# EAGLE design hib_main_7 (EAGLE 7.7.0)

## Sheet 1 of 3: Supply
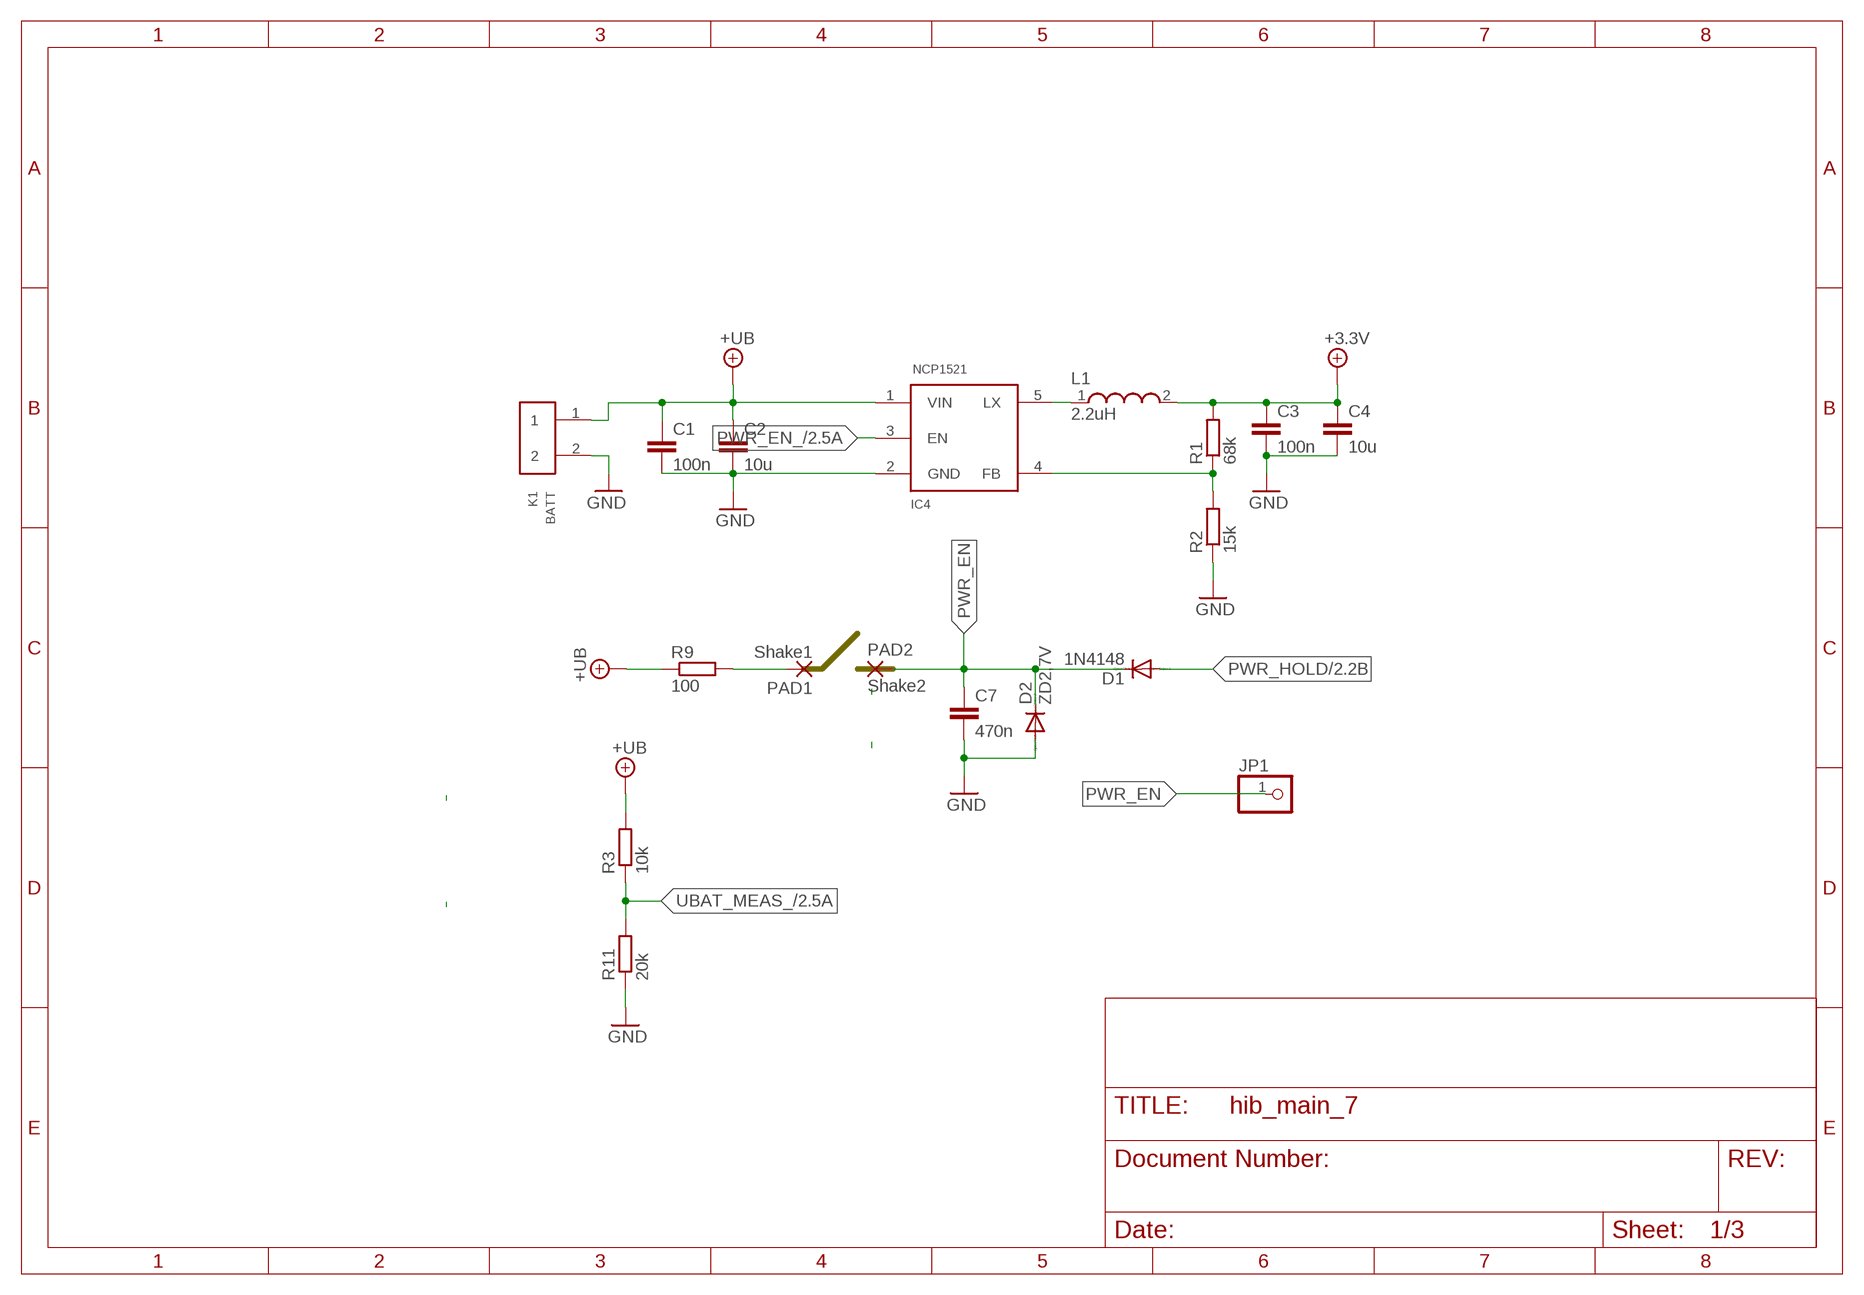
[diagram p0: schematic, sheet 1]

### Parts
C1  100n  C-EUC0805K  [C0805K]
C2  10u  C-EUC0805K  [C0805K]
C3  100n  C-EUC0805M  [C0805M]
C4  10u  C-EUC0805M  [C0805M]
C7  470n  C-EUC0805M  [C0805M]
D1  1N4148  DIODE-MINIMELF  [MINIMELF]
D2  ZD2,7V  DIODE-MINIMELF  [MINIMELF]
IC4  NCP1521  [SOT23-5L]
JP1  PINHD-1X1  [1X01]
K1  BATT  620102131822  [620102131822]
L1  2.2uH  WE-MPSB_0805(HC)  [WE-MPSB_0805(W=4.0)]
PAD1  Shake1  WIREPADSMD1,27-254  [SMD1,27-2,54]
PAD2  Shake2  WIREPADSMD1,27-254  [SMD1,27-2,54]
R1  68k  R-EU_R0603  [R0603]
R2  15k  R-EU_R0603  [R0603]
R3  10k  R-EU_R0603  [R0603]
R9  100  R-EU_R0603  [R0603]
R11  20k  R-EU_R0603  [R0603]

### Nets
+3,3V: C3.1 C4.1 L1.2 R1.2 ; supply symbol labelled +3.3V ; also sheet 2,3
+UB: C1.1 C2.1 IC4.1(VIN) K1.1 R3.2 R9.1 ; also sheet 3
GND: C1.2 C2.2 C3.2 C4.2 C7.2 D2.A IC4.2(GND) K1.2 R2.1 R11.1 ; also sheet 2,3
N$1: IC4.5(LX) L1.1
N$3: IC4.4(FB) R1.1 R2.2
N$11: PAD1.1(P) R9.2
PWR_EN: C7.1 D1.C D2.C JP1.1 PAD2.1(P)
PWR_EN_: IC4.3(EN) ; also sheet 2
PWR_HOLD: D1.A ; also sheet 2
UBAT_MEAS_: R3.1 R11.2 ; also sheet 2

## Sheet 2 of 3: Controller
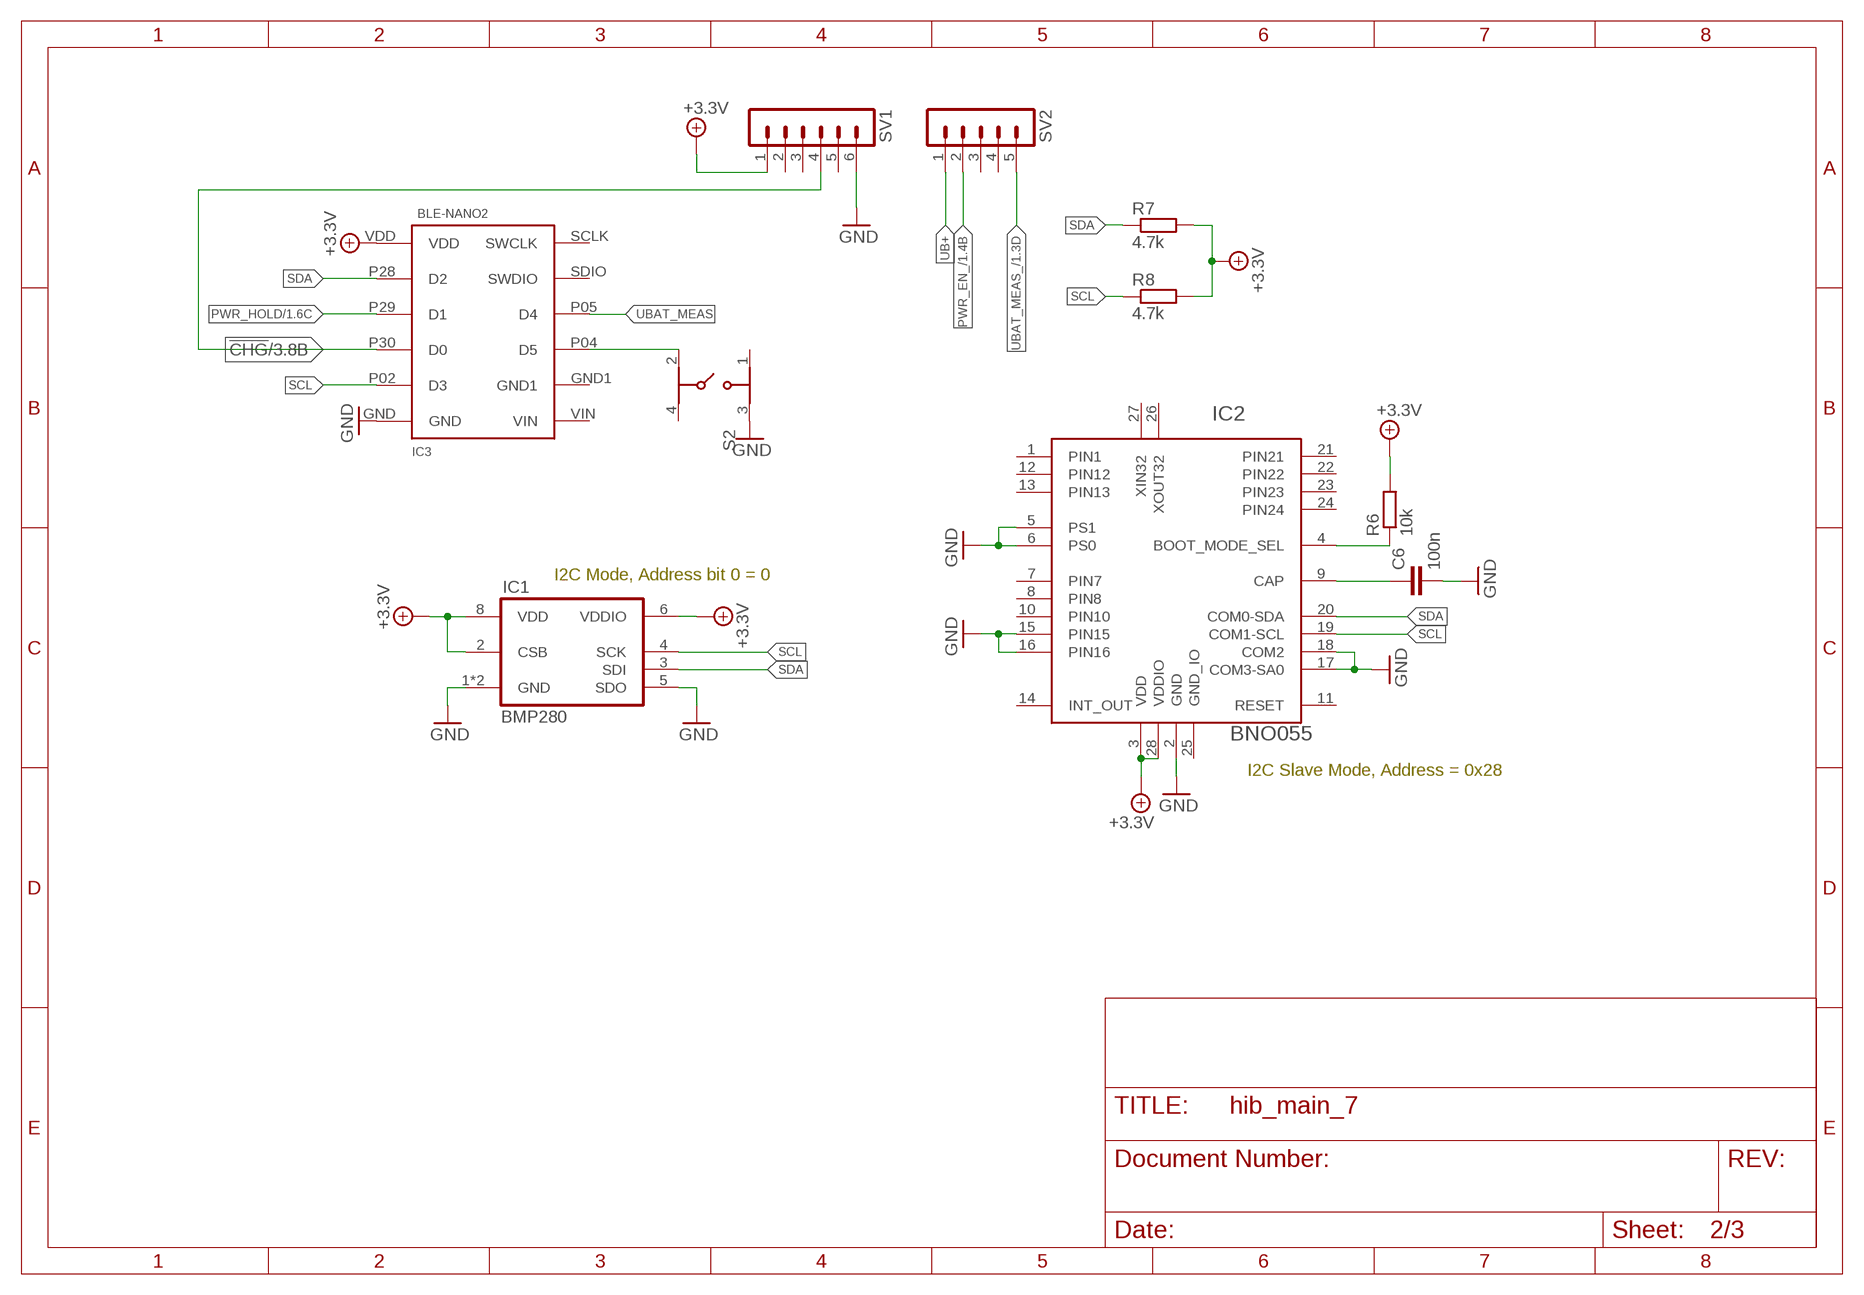
[diagram p1: schematic, sheet 2]

### Parts
C6  100n  C-EUC0805M  [C0805M]
IC1  BMP280  [BMP280]
IC2  BNO055  1658_BNO055  [LGA-28_3.80X5.20/0.5]
IC3  BLE-NANO2  [BLE-NANO2]
R6  10k  R-EU_R0805M  [R0805M]
R7  4.7k  R-EU_R0805M  [R0805M]
R8  4.7k  R-EU_R0805M  [R0805M]
S2  434153017835  [434153017835]
SV1  MA06-1  [MA06-1]
SV2  MA05-1  [MA05-1]

### Nets
!CHG!: IC3.P30(D0) SV1.4 ; also sheet 3
+3,3V: IC1.2(CSB) IC1.6(VDDIO) IC1.8(VDD) IC2.3(VDD) IC2.28(VDDIO) IC3.VDD R6.2 R7.2 R8.2 SV1.1 ; supply symbol labelled +3.3V ; also sheet 1,3
GND: C6.2 IC1.1(GND) IC1.5(SDO) IC1.7(GND) IC2.2(GND) IC2.5(PS1) IC2.6(PS0) IC2.15(PIN15) IC2.16(PIN16) IC2.17(COM3-SA0) IC2.18(COM2) IC3.GND S2.3 SV1.6 ; also sheet 1,3
N$4: C6.1 IC2.9(CAP)
N$6: IC2.4(BOOT_MODE_SEL) R6.1
PWR_EN_: SV2.2 ; also sheet 1
PWR_HOLD: IC3.P29(D1) ; also sheet 1
RESET: IC3.P04(D5) S2.2
SCL: IC1.4(SCK) IC2.19(COM1-SCL) IC3.P02(D3) R8.1
SDA: IC1.3(SDI) IC2.20(COM0-SDA) IC3.P28(D2) R7.1
UB+: SV2.1
UBAT_MEAS: IC3.P05(D4)
UBAT_MEAS_: SV2.5 ; also sheet 1
Unconnected: IC2.1(PIN1) IC2.7(PIN7) IC2.8(PIN8) IC2.10(PIN10) IC2.11(RESET) IC2.12(PIN12) IC2.13(PIN13) IC2.14(INT_OUT) IC2.21(PIN21) IC2.22(PIN22) IC2.23(PIN23) IC2.24(PIN24) IC2.26(XOUT32) IC2.27(XIN32) IC3.GND1 IC3.SCLK(SWCLK) IC3.SDIO(SWDIO) IC3.VIN S2.1 S2.4 SV1.2 SV1.3 SV1.5 SV2.3 SV2.4

### Notes on the sheet
- I2C Mode, Address bit 0 = 0
- I2C Slave Mode, Address = 0x28

## Sheet 3 of 3: Wireless supply
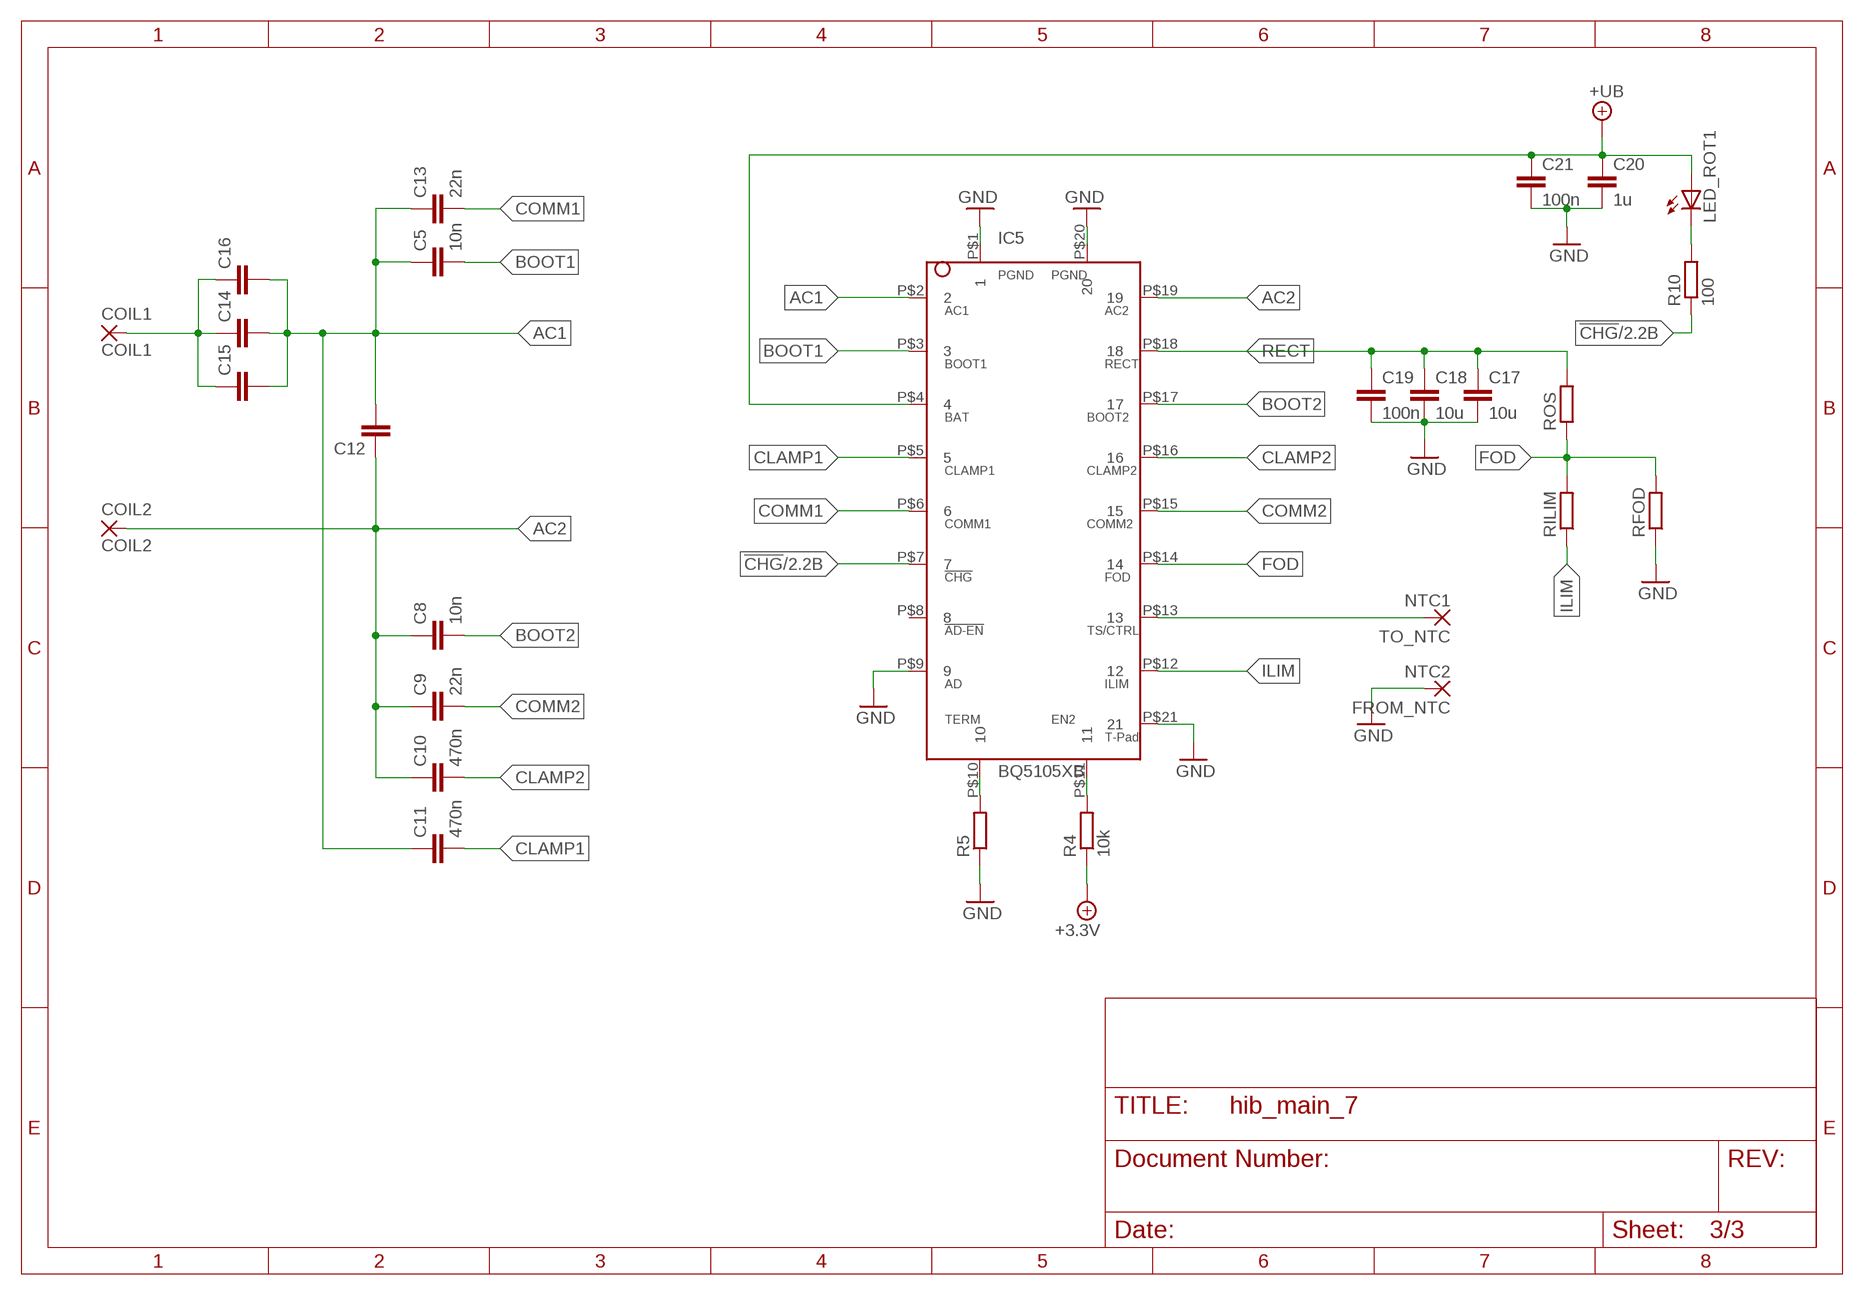
[diagram p2: schematic, sheet 3]

### Parts
C5  10n  C-EUC0603K  [C0603K]
C8  10n  C-EUC0603K  [C0603K]
C9  22n  C-EUC0603K  [C0603K]
C10  470n  C-EUC0603K  [C0603K]
C11  470n  C-EUC0603K  [C0603K]
C12  C-EUC0603K  [C0603K]
C13  22n  C-EUC0603K  [C0603K]
C14  C-EUC0603K  [C0603K]
C15  C-EUC0603K  [C0603K]
C16  C-EUC0603K  [C0603K]
C17  10u  C-EUC0603K  [C0603K]
C18  10u  C-EUC0603K  [C0603K]
C19  100n  C-EUC0603K  [C0603K]
C20  1u  C-EUC0603K  [C0603K]
C21  100n  C-EUC0603K  [C0603K]
COIL1  COIL1  WIREPADSMD1,27-254  [SMD1,27-2,54]
COIL2  COIL2  WIREPADSMD1,27-254  [SMD1,27-2,54]
FROM_NTC  NTC2  WIREPADSMD1,27-254  [SMD1,27-2,54]
IC5  BQ5105XB  [VQFN_BQ5105B]
LED_ROT1  LEDCHIP-LED0603  [CHIP-LED0603]
R4  10k  R-EU_R0805  [R0805]
R5  R-EU_R0603  [R0603]
R10  100  R-EU_R0603  [R0603]
RFOD  R-EU_R0805  [R0805]
RILIM  R-EU_R0805  [R0805]
ROS  R-EU_R0805  [R0805]
TO_NTC  NTC1  WIREPADSMD1,27-254  [SMD1,27-2,54]

### Nets
!CHG!: IC5.P$7 R10.1 ; also sheet 2
+3,3V: R4.1 ; supply symbol labelled +3.3V ; also sheet 1,2
+UB: C20.1 C21.1 IC5.P$4 LED_ROT1.A ; also sheet 1
AC1: C5.1 C11.1 C12.2 C13.1 C14.2 C15.2 C16.2 IC5.P$2
AC2: C8.1 C9.1 C10.1 C12.1 COIL2.1(P) IC5.P$19
BOOT1: C5.2 IC5.P$3
BOOT2: C8.2 IC5.P$17
CLAMP1: C11.2 IC5.P$5
CLAMP2: C10.2 IC5.P$16
COMM1: C13.2 IC5.P$6
COMM2: C9.2 IC5.P$15
FOD: IC5.P$14 RFOD.2 RILIM.2 ROS.1
GND: C17.2 C18.2 C19.2 C20.2 C21.2 FROM_NTC.1(P) IC5.P$1 IC5.P$9 IC5.P$20 IC5.P$21 R5.1 RFOD.1 ; also sheet 1,2
ILIM: IC5.P$12 RILIM.1
N$2: C14.1 C15.1 C16.1 COIL1.1(P)
N$5: IC5.P$10 R5.2
N$7: IC5.P$11 R4.2
N$8: LED_ROT1.C R10.2
RECT: C17.1 C18.1 C19.1 IC5.P$18 ROS.2
TS/CTRL: IC5.P$13 TO_NTC.1(P)
Unconnected: IC5.P$8

## Power pins joined to a net without a drawn wire
GND_IO: IC2.25(GND_IO)

## Library data of the parts
C1 C2 C5 C8-C21 = rcl@1:C-EU: CAPACITOR, European symbol
C3 C4 C6 C7 = rcl:C-EU: CAPACITOR, European symbol
COIL1 COIL2 FROM_NTC TO_NTC = wirepad@1:WIREPAD: Wire PAD connect wire on PCB
D1 D2 = diode:DIODE-: DIODE
IC1 = bosch-bmp280:BMP280: The BMP280 is an absolute barometric pressure sensor especially designed for mobile applications. The sensor module is housed in an extremely compact 8-pin metal-lid LGA package with a footprint of only 2.0 × 2.5 mm2 and 0.95 mm package height. Its small dimensions and its low power consumption of 2.7 μA @1Hz allow the implementation in battery driven devices such as mobile phones, GPS modules or watches. The library has been designed by Richard Magdycz <https://www.facebook.com/groups/eaglecadsoftUK>
IC2 = BNO055:1658_BNO055: BN055 Intelligent 9-axis absolute orientation sensor; PART_NUMBER: BNO055; VALUE: BN055
IC3 = redbearlabs:BLE-NANO2
IC4 = on-semiconductor:NCP1521: NCP1521B 1.5 MHz, 600 mA Step-Down DC-DC Converter
IC5 = BQ51050B_original:BQ5105XB
JP1 = pinhead:PINHD-1X1: PIN HEADER
K1 = Eagle_WIRE-TO-BOARD_rev15d:620102131822: WR-WTB 2.00mm SMT Male Horizontal Shrouded Header, 2 Pins=>Code : Con_WTB_2.00_PCB_SMT_620102131822 <http://katalog.we-online.de/media/thumbs2/eican/thb_Con_WTB_2.00_PCB_SMT_6201xx131822_pf2.jpg> Details see: http://katalog.we-online.de/en/em/620_1xx_131_822 Created 2014-06-05, Karrer Zheng 2014 (C) Würth Elektronik
L1 = EagleLibrary_Wuerth_Elektronik_eiSos_rev16a:WE-MPSB: SMD EMI Multilayer Power Suppression Bead Characteristics High rated current up to 10 A Operating temperature: –55 ºC to +125 ºC Very low RDC Applications 77 EMI suppression of DC/DC converters and DC power supply Variant abbreviation WB means WIDE BAND HS means HIGH SPEED HC means HIGH CURRENT <http://katalog.we-online.de/media/images/eisos/FeMPSB_pf2.jpg> Details see: http://katalog.we-online.de/en/pbs/WE-MPSB? Updated by Dan Xu 2014-07-08 2014 (C) Wurth Elektronik
LED_ROT1 = led:LED: LED OSRAM: - CHIPLED LG R971, LG N971, LY N971, LG Q971, LY Q971, LO R971, LY R971 LH N974, LH R974 LS Q976, LO Q976, LY Q976 LO Q996 - Hyper CHIPLED LW Q18S LB Q993, LB Q99A, LB R99A - SideLED LS A670, LO A670, LY A670, LG A670, LP A670 LB A673, LV A673, LT A673, LW A673 LH A674 LY A675 LS A676, LA A676, LO A676, LY A676, LW A676 LS A679, LY A679, LG A679 - Hyper Micro SIDELED® LS Y876, LA Y876, LO Y876, LY Y876 LT Y87S - SmartLED LW L88C, LW L88S LB L89C, LB L89S, LG L890 LS L89K, LO L89K, LY L89K LS L896, LA L896, LO L896, LY L896 - TOPLED LS T670, LO T670, LY T670, LG T670, LP T670 LSG T670, LSP T670, LSY T670, LOP T670, LYG T670 LG T671, LOG T671, LSG T671 LB T673, LV T673, LT T673, LW T673 LH T674 LS T676, LA T676, LO T676, LY T676, LB T676, LH T676, LSB T676, LW T676 LB T67C, LV T67C, LT T67C, LS T67K, LO T67K, LY T67K, LW E67C LS E67B, LA E67B, LO E67B, LY E67B, LB E67C, LV E67C, LT E67C LW T67C LS T679, LY T679, LG T679 LS T770, LO T770, LY T770, LG T770, LP T770 LB T773, LV T773, LT T773, LW T773 LH T774 LS E675, LA E675, LY E675, LS T675 LS T776, LA T776, LO T776, LY T776, LB T776 LHGB T686 LT T68C, LB T68C - Hyper Mini TOPLED® LB M676 - Mini TOPLED Santana® LG M470 LS M47K, LO M47K, LY M47K Source: http://www.osram.convergy.de LUXEON: - LUMILED® LXK2-PW12-R00, LXK2-PW12-S00, LXK2-PW14-U00, LXK2-PW14-V00 LXK2-PM12-R00, LXK2-PM12-S00, LXK2-PM14-U00 LXK2-PE12-Q00, LXK2-PE12-R00, LXK2-PE12-S00, LXK2-PE14-T00, LXK2-PE14-U00 LXK2-PB12-K00, LXK2-PB12-L00, LXK2-PB12-M00, LXK2-PB14-N00, LXK2-PB14-P00, LXK2-PB14-Q00 LXK2-PR12-L00, LXK2-PR12-M00, LXK2-PR14-Q00, LXK2-PR14-R00 LXK2-PD12-Q00, LXK2-PD12-R00, LXK2-PD12-S00 LXK2-PH12-R00, LXK2-PH12-S00 LXK2-PL12-P00, LXK2-PL12-Q00, LXK2-PL12-R00 Source: www.luxeon.com KINGBRIGHT: KA-3528ASYC Source: www.kingbright.com
PAD1 PAD2 = wirepad:WIREPAD: Wire PAD connect wire on PCB
R1-R3 R6-R9 R11 = rcl:R-EU_: RESISTOR, European symbol
R4 R5 R10 RFOD RILIM ROS = rcl@1:R-EU_: RESISTOR, European symbol
S2 = EAGLE-TACT_SWITCHES-rev16e:434153017835: WS-TASV Tact Switch J-Bend SMD version Specification Rating : 50mA, 12VDC Contact Resistance Initial: 100mΩ max. After life test:1mΩ max. Insulation Resistance: min.100MΩ at 500VDC Dielectric Strength : 250VAC for 1 minute Stroke:0.15±0.1mm Bounce :10ms max. Material Cover : : Stainless steel Stem :LCP UL 94 V-0. FramePA46 UL HB, color Black >Contact : Stainless Steel with Silver Tape:Polyimide tape Terminal : Copper Alloy with Silver <http://katalog.we-online.de/media/images/v2/WS-TASU_434331013822_a_4C.jpg> Details see: http://katalog.we-online.de/em/datasheet/434153017835.pdf 2015 (C) Würth Elektronik
SV1 = con-lstb:MA06-1: PIN HEADER; OC_FARNELL: unknown; OC_NEWARK: unknown
SV2 = con-lstb:MA05-1: PIN HEADER; OC_FARNELL: unknown; OC_NEWARK: unknown

## Board
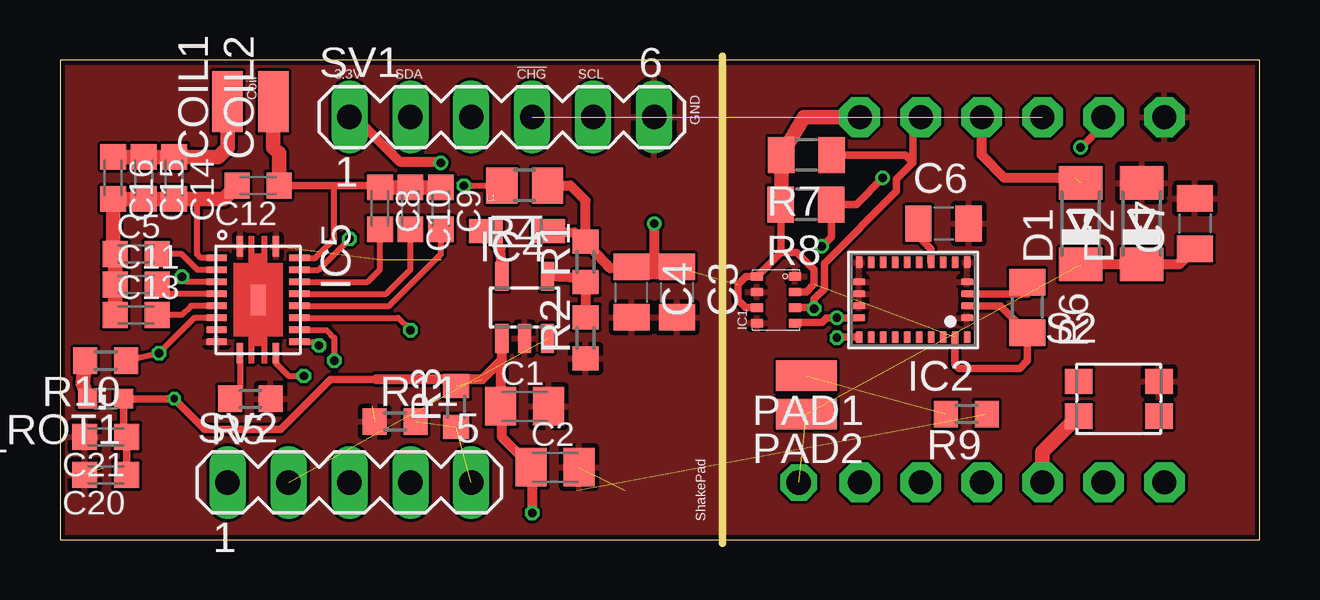
[diagram p3: board, top side]
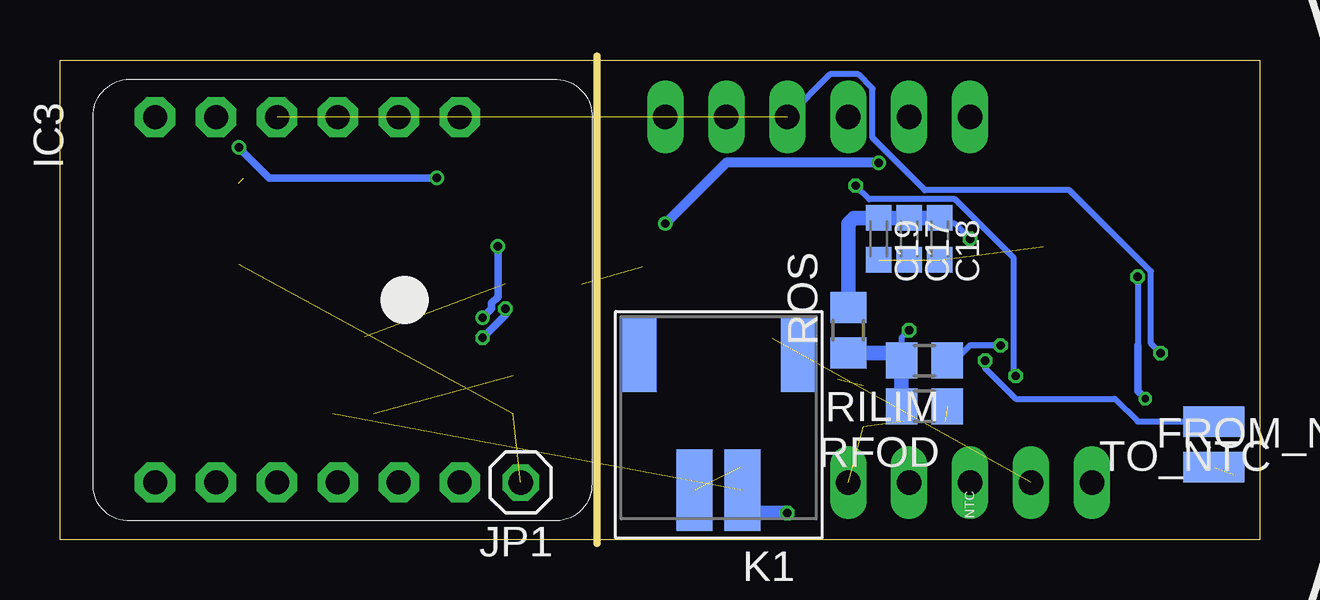
[diagram p4: board, bottom side, seen from below]

Size 50 x 20 mm. Coordinates in mm from the lower left corner, seen from the top.
Outline: 0,0 50,0 50,20 0,20 0,0
Copper layers (1*16): Top 0.018mm / dielectric 1.55mm / Bottom 0.018mm
Design rules "Multi-CB_2L_125um-Tracks_OL35um": minimum track width 0.125mm, minimum drill 0.2mm, track to track 0.125mm, track to pad 0.125mm, pad to pad 0.125mm, via to via 0.125mm, smd to smd 0mil, copper to edge 0.2mm, drill to drill 0.2mm, minimum pad ring 0.125mm, minimum via ring 0.125mm, stop-mask expansion 2mil, vias tented up to drill 0.45mm, thermal gap 0.2mm
Milling: 1 lines

### Footprints (pad centres in the part's own frame; a part is rotated, then mirrored left to right if it is on the bottom)
C0805K = smd 1.3 x 1.6: 1 -1,0; 2 1,0
C0805M = smd 1.1 x 1.5: 1 -1.05,0; 2 1.05,0
C0603K = smd 1.05 x 1.08: 1 -0.875,0; 2 0.875,0
SMD1,27-2,54 = smd 1.27 x 2.54: 1 0,0
MINIMELF = smd 1.4 x 1.8: A 1.7,0; C -1.7,0
BMP280 = smd 0.35 x 0.5: 1 0.975,-0.8; 2 0.325,-0.8; 3 -0.325,-0.8; 4 -0.975,-0.8; 5 -0.975,0.8; 6 -0.325,0.8; 7 0.325,0.8; 8 0.975,0.8
LGA-28_3.80X5.20/0.5 = smd 0.3 x 0.5: 1 -2.25,1.56; 6 -2.25,-1.56; 7 -1.75,-1.56; 8 -1.25,-1.56; 9 -0.75,-1.56; 10 -0.25,-1.56; 11 0.25,-1.56; 12 0.75,-1.56; 13 1.25,-1.56; 14 1.75,-1.56; 15 2.25,-1.56; 20 2.25,1.56; 21 1.75,1.56; 22 1.25,1.56; 23 0.75,1.56; 24 0.25,1.56; 25 -0.25,1.56; 26 -0.75,1.56; 27 -1.25,1.56; 28 -1.75,1.56 | smd 0.5 x 0.3: 2 -2.25,0.75; 3 -2.25,0.25; 4 -2.25,-0.25; 5 -2.25,-0.75; 16 2.25,-0.75; 17 2.25,-0.25; 18 2.25,0.25; 19 2.25,0.75
BLE-NANO2 = drill 1 pad 1.676 octagon: GND 0,0; GND1 15.24,2.54; P02 0,2.54; P04 15.24,5.08; P05 15.24,7.62; P28 0,10.16; P29 0,7.62; P30 0,5.08; SCLK 15.24,12.7; SDIO 15.24,10.16; VDD 0,12.7; VIN 15.24,0
SOT23-5L = smd 0.55 x 1.2: 1 -0.95,-1.3; 2 0,-1.3; 3 0.95,-1.3; 4 0.95,1.3; 5 -0.95,1.3
VQFN_BQ5105B = smd 0.85 x 0.28: P$1 -2.225,-0.75; P$10 2.225,-0.75; P$11 2.225,0.75; P$20 -2.225,0.75 | smd 0.28 x 0.85: P$2 -1.75,-1.725; P$3 -1.25,-1.725; P$4 -0.75,-1.725; P$5 -0.25,-1.725; P$6 0.25,-1.725; P$7 0.75,-1.725; P$8 1.25,-1.725; P$9 1.75,-1.725; P$12 1.75,1.725; P$13 1.25,1.725; P$14 0.75,1.725; P$15 0.25,1.725; P$16 -0.25,1.725; P$17 -0.75,1.725; P$18 -1.25,1.725; P$19 -1.75,1.725 | smd 1.27 x 0.635: P$21 0,0
1X01 = drill 1.016 octagon: 1 0,0
620102131822 = smd 1.5 x 3.4: 1 -1,0; 2 1,0 | smd 1.4 x 3.1: Z1 -3.3,-5.65; Z2 3.3,-5.65
WE-MPSB_0805(W=4.0) = smd 1.4 x 1: 1 -1.3,0; 2 1.3,0
CHIP-LED0603 = smd 0.8 x 0.8: A 0,-0.75; C 0,0.75
R0603 = smd 1 x 1.1: 1 -0.85,0; 2 0.85,0
R0805 = smd 1.3 x 1.5: 1 -0.95,0; 2 0.95,0
R0805M = smd 1.1 x 1.5: 1 -1.05,0; 2 1.05,0
434153017835 = smd 1.15 x 1.05: 1 -1.675,0.725; 2 -1.675,-0.725; 3 1.675,0.725; 4 1.675,-0.725
MA06-1 = drill 1.016 long: 1 -6.35,0; 2 -3.81,0; 3 -1.27,0; 4 1.27,0; 5 3.81,0; 6 6.35,0
MA05-1 = drill 1.016 long: 1 -5.08,0; 2 -2.54,0; 3 0,0; 4 2.54,0; 5 5.08,0

### Placement (x,y rotation side)
C1  19.37,5.55 0 top
C2  20.64,3.01 0 top
C3  25.72,10.32 270 top
C4  23.81,10.32 270 top
C5  3.17,11.9 0 top
C6  36.83,13.18 0 top
C7  47.31,13.18 90 top
C8  13.34,13.81 270 top
C9  15.88,13.81 270 top
C10  14.61,13.81 270 top
C11  3.17,10.63 0 top
C12  8.26,14.76 180 top
C13  3.17,9.37 0 top
C14  4.76,15.08 270 top
C15  3.49,15.08 270 top
C16  2.22,15.08 270 top
C17  14.61,12.54 270 bottom
C18  13.34,12.54 270 bottom
C19  15.88,12.54 270 bottom
C20  1.91,2.7 180 top
C21  1.91,4.29 180 top
COIL1  6.99,18.26 0 top
COIL2  8.89,18.26 0 top
D1  42.55,13.18 90 top
D2  45.09,13.18 90 top
FROM_NTC  1.91,3.01 270 bottom
IC1  29.84,10 90 top
IC2  35.56,10 180 top
IC3  46.04,17.62 270 bottom
IC4  19.37,9.68 0 top
IC5  8.26,10 270 top
JP1  30.8,2.38 180 bottom
K1  22.54,2.06 180 bottom
L1  19.05,12.86 0 top
LED_ROT1  1.91,5.87 90 top
PAD1  31.11,6.83 90 top
PAD2  31.11,5.24 90 top
R1  21.91,11.59 90 top
R2  21.91,8.41 90 top
R3  16.51,5.55 90 top
R4  19.37,14.76 180 top
R5  7.94,5.87 180 top
R6  40.32,9.68 270 top
R7  31.11,16.03 180 top
R8  31.1,13.98 180 top
R9  37.78,5.24 180 top
R10  1.91,7.46 180 top
R11  13.97,4.92 0 top
RFOD  13.97,5.55 180 bottom
RILIM  13.97,7.46 180 bottom
ROS  17.14,8.73 90 bottom
S2  44.13,5.87 0 top
SV1  18.41,17.62 0 top
SV2  12.06,2.38 0 top
TO_NTC  1.91,4.92 90 bottom

### Tracks (layer width: path | path; a pad name or v marks a point on that pad's centre or on a via)
!CHG!  (via drill 0.35)  (1 unrouted)
  Top 0.254: IC5.P$7 5.6,9.25 v4.13,7.78 v4.12,7.78 R10.1
  Bottom 0.254: v4.13,7.78 4.53,8.18 4.53,11.18 7.92,14.57 13.95,14.57 16.13,16.75 16.13,18.8 16.73,19.4 17.91,19.4 SV1.4
+3,3V  (via drill 0.35)  (2 unrouted)
  Top 0.305: IC2.3 39.2,9.75 R6.2 40.32,7.46 40.01,7.14 37.47,7.14 37.31,7.3 IC2.28 | 30.05,11.98 IC1.8 28.6,10.97 28.26,10.63 28.26,10 28.57,9.68 29.04,9.68 IC1.6 | 30.05,11.98 R8.2 | IC1.2 31.11,10.32 | 31.11,10.32 | 31.11,10.32 31.43,10.65 31.43,11.27 30.73,11.98 30.05,11.98
  Top 0.406: L1.2 21.44,12.81 R1.2 | R1.2 22.93,11.32 C4.1 | R1.2 21.91,14.13 21.27,14.76 R4.1 | SV1.1 12.3,17.62 14.15,15.77 15.82,15.77 v15.88,15.71 | v24.77,13.18 24.77,11.37
  Top 0.61: R8.2 30.07,14 R7.2 31.02,17.62 IC3.VDD
  Top 1.016: C3.1 24.77,11.37 C4.1
  Bottom 0.406: v15.88,15.71 22.23,15.71 v24.77,13.18
+UB  (via drill 0.3, 0.35)  (2 unrouted)
  Top 0.254: IC5.P$4 5.28,10.75 v5.08,10.95
  Top 0.305: 13.19,6.68 11.29,6.68 9.21,4.6 6.03,4.6 v4.76,5.87 LED_ROT1.A 2.65,4.41 C21.1 C20.1
  Top 0.406: IC4.1 18.42,7.5 18.37,7.46 | 18.37,7.46 17.6,6.68 13.19,6.68 | 18.37,7.46 C1.1 18.41,5.51 18.41,4.29 19.64,3.06 C2.1 19.68,2.97 v19.68,1.11
  Bottom 0.254: v5.08,10.95 5.08,8.1
  Bottom 0.305: 5.08,8.1 5.08,6.19 v4.76,5.87
  Bottom 0.61: v19.68,1.11 20.95,1.11 21.54,1.7 K1.1
AC1
  Top 0.254: IC5.P$2 5.87,11.75 5.71,11.9 5.71,14.21
  Top 0.61: C13.1 C11.1 C5.1 2.22,11.98 C16.2 C15.2 C14.2 5.71,14.21 6.82,14.21 C12.2
AC2
  Top 0.254: IC5.P$19 10.64,11.75 11.43,12.54 11.43,14.76
  Top 0.305: C8.1 13.26,14.76 11.43,14.76 C12.1
  Top 0.61: C8.1 C10.1 C9.1 | C12.1 9.13,16.11 8.89,16.35 COIL2.1
BOOT1
  Top 0.254: IC5.P$3 5.74,11.25 5.08,11.9 C5.2
BOOT2
  Top 0.254: IC5.P$17 12.81,10.75 13.34,11.27 C8.2
CLAMP1
  Top 0.254: IC5.P$5 4.43,10.25 C11.2
CLAMP2
  Top 0.254: IC5.P$16 13.59,10.25 14.61,11.27 C10.2
COMM1
  Top 0.254: IC5.P$6 5.46,9.75 5.08,9.37 C13.2
COMM2
  Top 0.254: IC5.P$15 13.72,9.75 15.88,11.9 C9.2
FOD  (via drill 0.35)
  Top 0.254: IC5.P$14 14.09,9.25 v14.61,8.73
  Bottom 0.254: v14.61,8.73 14.92,8.41 RILIM.2
  Bottom 0.61: ROS.1 14.61,7.78 RILIM.2 RFOD.2
GND  (6 unrouted)
  pour Top: 0,20.16 0,-0.16 50.16,-0.16 50.16,20.16
ILIM  (via drill 0.35)
  Top 0.254: IC5.P$12 10.64,8.25 v10.79,8.1
  Bottom 0.254: v10.79,8.1 12.06,8.1 12.7,7.46 RILIM.1
N$1
  Top 0.406: IC4.5 18.37,12.14 L1.1
N$2
  Top 0.61: C16.1 C15.1 C14.1 6.59,15.96 6.99,16.35 COIL1.1
N$3
  Top 0.406: IC4.4 21.61,10.94 R1.1 R2.2
N$4
  Top 0.305: IC2.9 36.31,12.11 35.88,12.54 35.88,13.08 C6.1
N$5
  Top 0.254: IC5.P$10 7.5,6.29 R5.2
N$6
  Top 0.305: IC2.4 40.32,10.25 R6.1
N$7  (via drill 0.35)
  Top 0.254: IC5.P$11 9.01,7.35 9.53,6.83 v10.16,6.83 | v16.84,14.76 R4.2
  Bottom 0.254: v10.16,6.83 10.24,6.91 10.24,11.74 12.69,14.19 16.27,14.19 v16.84,14.76
N$8
  Top 0.61: LED_ROT1.C 0.95,6.5 R10.2
N$11  (1 unrouted)
PWR_EN  (2 unrouted)
  Top 0.406: D1.C D2.C 46.66,11.47 C7.1
PWR_EN_  (1 unrouted)
PWR_HOLD  (1 unrouted)
  Top 0.406: 42.34,15.08 39.37,15.08 38.42,16.03 IC3.P29
RECT  (via drill 0.35)
  Top 0.254: IC5.P$18 10.78,11.25 v12.06,12.54
  Bottom 0.254: v12.06,12.54 12.7,13.18 13.1,13.18 C18.1
  Bottom 0.61: C18.1 C17.1 C19.1 16.91,13.41 17.14,13.18 ROS.2
RESET
  Top 0.61: S2.2 40.96,3.65 IC3.P04
SCL  (via drill 0.35)
  Top 0.305: IC2.19 v32.38,9.25 31.95,9.25 31.75,9.05 30.67,9.05 IC1.4 | v31.75,12.22 32.15,12.62 R8.1 33.19,13.98 v34.29,15.08 | v42.55,16.35 43.5,17.3 IC3.P02
  Bottom 0.305: v31.75,12.22 31.75,10.12 32.01,9.86 32.01,9.62 v32.38,9.25 | v34.29,15.08 41.27,15.08 v42.55,16.35
SDA  (via drill 0.35)
  Top 0.305: IC2.20 32.41,8.44 v32.38,8.41 | IC1.3 31.38,9.68 v31.43,9.62 31.43,10.03 31.86,10.46 31.86,11.52 34.87,14.52 34.87,15.02 35.56,15.71 | 35.56,15.71 35.56,17.3 IC3.P28 | R7.1 35.24,16.03 35.56,15.71
  Bottom 0.305: v32.38,8.41 31.43,9.37 v31.43,9.62
TS/CTRL  (via drill 0.35)
  Top 0.254: IC5.P$13 10,8.73 11.11,8.73 11.43,8.41 v11.43,7.46
  Bottom 0.254: v11.43,7.46 11.43,7.14 10.16,5.87 6.03,5.87 5.08,4.92 TO_NTC.1
UBAT_MEAS_  (2 unrouted)

### Text on the board
tPlace: 3.3V | SDA | !CHG! | SCL | Coil | GND | ShakePad
bPlace: NTC